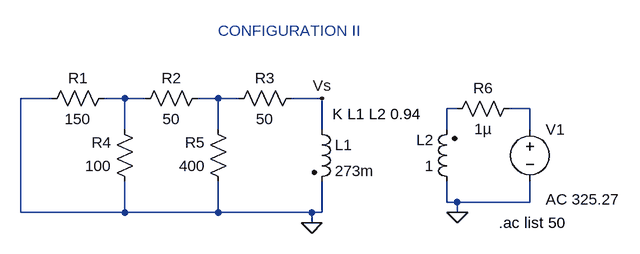
[diagram p0: schematic EXP1_PART2_CIRCUITO2.asc]
EXP1_PART2_CIRCUITO2.asc, the LTspice schematic file:
Version 4
SHEET 1 880 680
WIRE -64 96 -112 96
WIRE 48 96 16 96
WIRE 80 96 48 96
WIRE 192 96 160 96
WIRE 224 96 192 96
WIRE 352 96 304 96
WIRE 560 112 544 112
WIRE 672 112 640 112
WIRE 48 144 48 96
WIRE 192 144 192 96
WIRE 352 144 352 96
WIRE 544 144 544 112
WIRE 672 144 672 112
WIRE 544 256 544 224
WIRE 560 256 544 256
WIRE 672 256 672 224
WIRE 672 256 560 256
WIRE -112 272 -112 96
WIRE 48 272 48 224
WIRE 48 272 -112 272
WIRE 192 272 192 224
WIRE 192 272 48 272
WIRE 336 272 192 272
WIRE 352 272 352 224
WIRE 352 272 336 272
WIRE 560 272 560 256
WIRE 336 288 336 272
FLAG 336 288 0
FLAG 560 272 0
FLAG 352 96 Vs
SYMBOL res 32 80 R90
WINDOW 0 0 56 VBottom 2
WINDOW 3 32 56 VTop 2
SYMATTR InstName R1
SYMATTR Value 150
SYMBOL res 176 80 R90
WINDOW 0 0 56 VBottom 2
WINDOW 3 32 56 VTop 2
SYMATTR InstName R2
SYMATTR Value 50
SYMBOL res 320 80 R90
WINDOW 0 0 56 VBottom 2
WINDOW 3 32 56 VTop 2
SYMATTR InstName R3
SYMATTR Value 50
SYMBOL res 64 240 R180
WINDOW 0 36 76 Left 2
WINDOW 3 36 40 Left 2
SYMATTR InstName R4
SYMATTR Value 100
SYMBOL res 208 240 R180
WINDOW 0 36 76 Left 2
WINDOW 3 36 40 Left 2
SYMATTR InstName R5
SYMATTR Value 400
SYMBOL ind2 336 128 R0
SYMATTR InstName L1
SYMATTR Value 273m
SYMATTR Type ind
SYMBOL ind2 560 240 R180
WINDOW 0 36 80 Left 2
WINDOW 3 36 40 Left 2
SYMATTR InstName L2
SYMATTR Value 1
SYMATTR Type ind
SYMBOL voltage 672 128 R0
WINDOW 123 24 124 Left 2
WINDOW 39 0 0 Left 0
SYMATTR Value2 AC 325.27
SYMATTR InstName V1
SYMATTR Value ""
SYMBOL res 656 96 R90
WINDOW 0 0 56 VBottom 2
WINDOW 3 32 56 VTop 2
SYMATTR InstName R6
SYMATTR Value 1µ
TEXT 368 120 Left 2 !K L1 L2 0.94
TEXT 192 -8 Left 2 ;CONFIGURATION II
TEXT 624 288 Left 2 !.ac list 50

The netlist it stands for:
* EXP1_PART2_CIRCUITO2.asc
R1 N001 0 150
R2 N002 N001 50
R3 Vs N002 50
R4 0 N001 100
R5 0 N002 400
L1 Vs 0 273m
L2 0 N003 1
V1 N004 0 AC 325.27
R6 N004 N003 1µ
K L1 L2 0.94
* CONFIGURATION II
.ac list 50
.backanno
.end